# EAGLE design shiftReg (EAGLE 9.6.2)
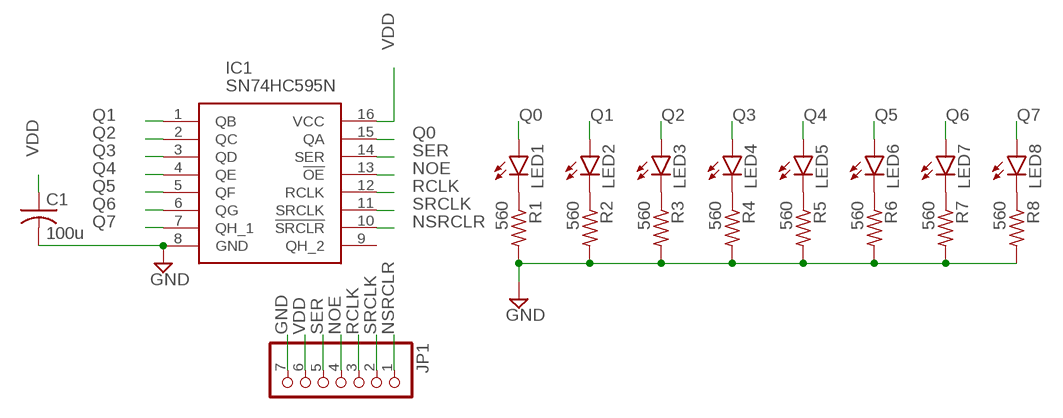
[diagram p0: schematic, sheet 1]

## Parts
C1  100u  C-USC0805  [C0805]
IC1  SN74HC595N  [DIP794W53P254L1930H508Q16N]
JP1  PINHD-1X7  [1X07]
LED1  LEDCHIP-LED0805  [CHIP-LED0805]
LED2  LEDCHIP-LED0805  [CHIP-LED0805]
LED3  LEDCHIP-LED0805  [CHIP-LED0805]
LED4  LEDCHIP-LED0805  [CHIP-LED0805]
LED5  LEDCHIP-LED0805  [CHIP-LED0805]
LED6  LEDCHIP-LED0805  [CHIP-LED0805]
LED7  LEDCHIP-LED0805  [CHIP-LED0805]
LED8  LEDCHIP-LED0805  [CHIP-LED0805]
R1  560  R-US_R0805  [R0805]
R2  560  R-US_R0805  [R0805]
R3  560  R-US_R0805  [R0805]
R4  560  R-US_R0805  [R0805]
R5  560  R-US_R0805  [R0805]
R6  560  R-US_R0805  [R0805]
R7  560  R-US_R0805  [R0805]
R8  560  R-US_R0805  [R0805]

## Nets
GND: C1.2 IC1.8(GND) JP1.7 R1.2 R2.2 R3.2 R4.2 R5.2 R6.2 R7.2 R8.2
N$2: LED1.C R1.1
N$3: LED2.C R2.1
N$4: LED3.C R3.1
N$5: LED4.C R4.1
N$6: LED5.C R5.1
N$7: LED6.C R6.1
N$8: LED7.C R7.1
N$9: LED8.C R8.1
NOE: IC1.13(!OE) JP1.4
NSRCLR: IC1.10(!SRCLR) JP1.1
Q0: IC1.15(QA) LED1.A
Q1: IC1.1(QB) LED2.A
Q2: IC1.2(QC) LED3.A
Q3: IC1.3(QD) LED4.A
Q4: IC1.4(QE) LED5.A
Q5: IC1.5(QF) LED6.A
Q6: IC1.6(QG) LED7.A
Q7: IC1.7(QH_1) LED8.A
RCLK: IC1.12(RCLK) JP1.3
SER: IC1.14(SER) JP1.5
SRCLK: IC1.11(SRCLK) JP1.2
VDD: C1.1 IC1.16(VCC) JP1.6
Unconnected: IC1.9(QH_2)

## Library data of the parts
C1 = rcl:C-US: CAPACITOR, American symbol; SPICEPREFIX: C
IC1 = SamacSys_Parts:SN74HC595N: 8-Bit Shift Registers With 3-State Output Registers Source: Datasheet <http://www.ti.com/lit/ds/symlink/sn74hc595.pdf>; DESCRIPTION: 8-Bit Shift Registers With 3-State Output Registers; HEIGHT: 5.08mm; MANUFACTURER_NAME: Texas Instruments; MANUFACTURER_PART_NUMBER: SN74HC595N; MOUSER_PART_NUMBER: 595-SN74HC595N; MOUSER_PRICE-STOCK: https://www.mouser.co.uk/ProductDetail/Texas-Instruments/SN74HC595N?qs=IEl3ej0IqwBTHkYa8XPoMQ%3D%3D
JP1 = pinhead:PINHD-1X7: PIN HEADER
LED1-LED8 = led:LED: LED OSRAM: - CHIPLED LG R971, LG N971, LY N971, LG Q971, LY Q971, LO R971, LY R971 LH N974, LH R974 LS Q976, LO Q976, LY Q976 LO Q996 - Hyper CHIPLED LW Q18S LB Q993, LB Q99A, LB R99A - SideLED LS A670, LO A670, LY A670, LG A670, LP A670 LB A673, LV A673, LT A673, LW A673 LH A674 LY A675 LS A676, LA A676, LO A676, LY A676, LW A676 LS A679, LY A679, LG A679 - Hyper Micro SIDELED® LS Y876, LA Y876, LO Y876, LY Y876 LT Y87S - SmartLED LW L88C, LW L88S LB L89C, LB L89S, LG L890 LS L89K, LO L89K, LY L89K LS L896, LA L896, LO L896, LY L896 - TOPLED LS T670, LO T670, LY T670, LG T670, LP T670 LSG T670, LSP T670, LSY T670, LOP T670, LYG T670 LG T671, LOG T671, LSG T671 LB T673, LV T673, LT T673, LW T673 LH T674 LS T676, LA T676, LO T676, LY T676, LB T676, LH T676, LSB T676, LW T676 LB T67C, LV T67C, LT T67C, LS T67K, LO T67K, LY T67K, LW E67C LS E67B, LA E67B, LO E67B, LY E67B, LB E67C, LV E67C, LT E67C LW T67C LS T679, LY T679, LG T679 LS T770, LO T770, LY T770, LG T770, LP T770 LB T773, LV T773, LT T773, LW T773 LH T774 LS E675, LA E675, LY E675, LS T675 LS T776, LA T776, LO T776, LY T776, LB T776 LHGB T686 LT T68C, LB T68C - Hyper Mini TOPLED® LB M676 - Mini TOPLED Santana® LG M470 LS M47K, LO M47K, LY M47K Source: http://www.osram.convergy.de LUXEON: - LUMILED® LXK2-PW12-R00, LXK2-PW12-S00, LXK2-PW14-U00, LXK2-PW14-V00 LXK2-PM12-R00, LXK2-PM12-S00, LXK2-PM14-U00 LXK2-PE12-Q00, LXK2-PE12-R00, LXK2-PE12-S00, LXK2-PE14-T00, LXK2-PE14-U00 LXK2-PB12-K00, LXK2-PB12-L00, LXK2-PB12-M00, LXK2-PB14-N00, LXK2-PB14-P00, LXK2-PB14-Q00 LXK2-PR12-L00, LXK2-PR12-M00, LXK2-PR14-Q00, LXK2-PR14-R00 LXK2-PD12-Q00, LXK2-PD12-R00, LXK2-PD12-S00 LXK2-PH12-R00, LXK2-PH12-S00 LXK2-PL12-P00, LXK2-PL12-Q00, LXK2-PL12-R00 Source: www.luxeon.com KINGBRIGHT: KA-3528ASYC Source: www.kingbright.com
R1-R8 = rcl:R-US_: RESISTOR, American symbol; SPICEPREFIX: R

## Board
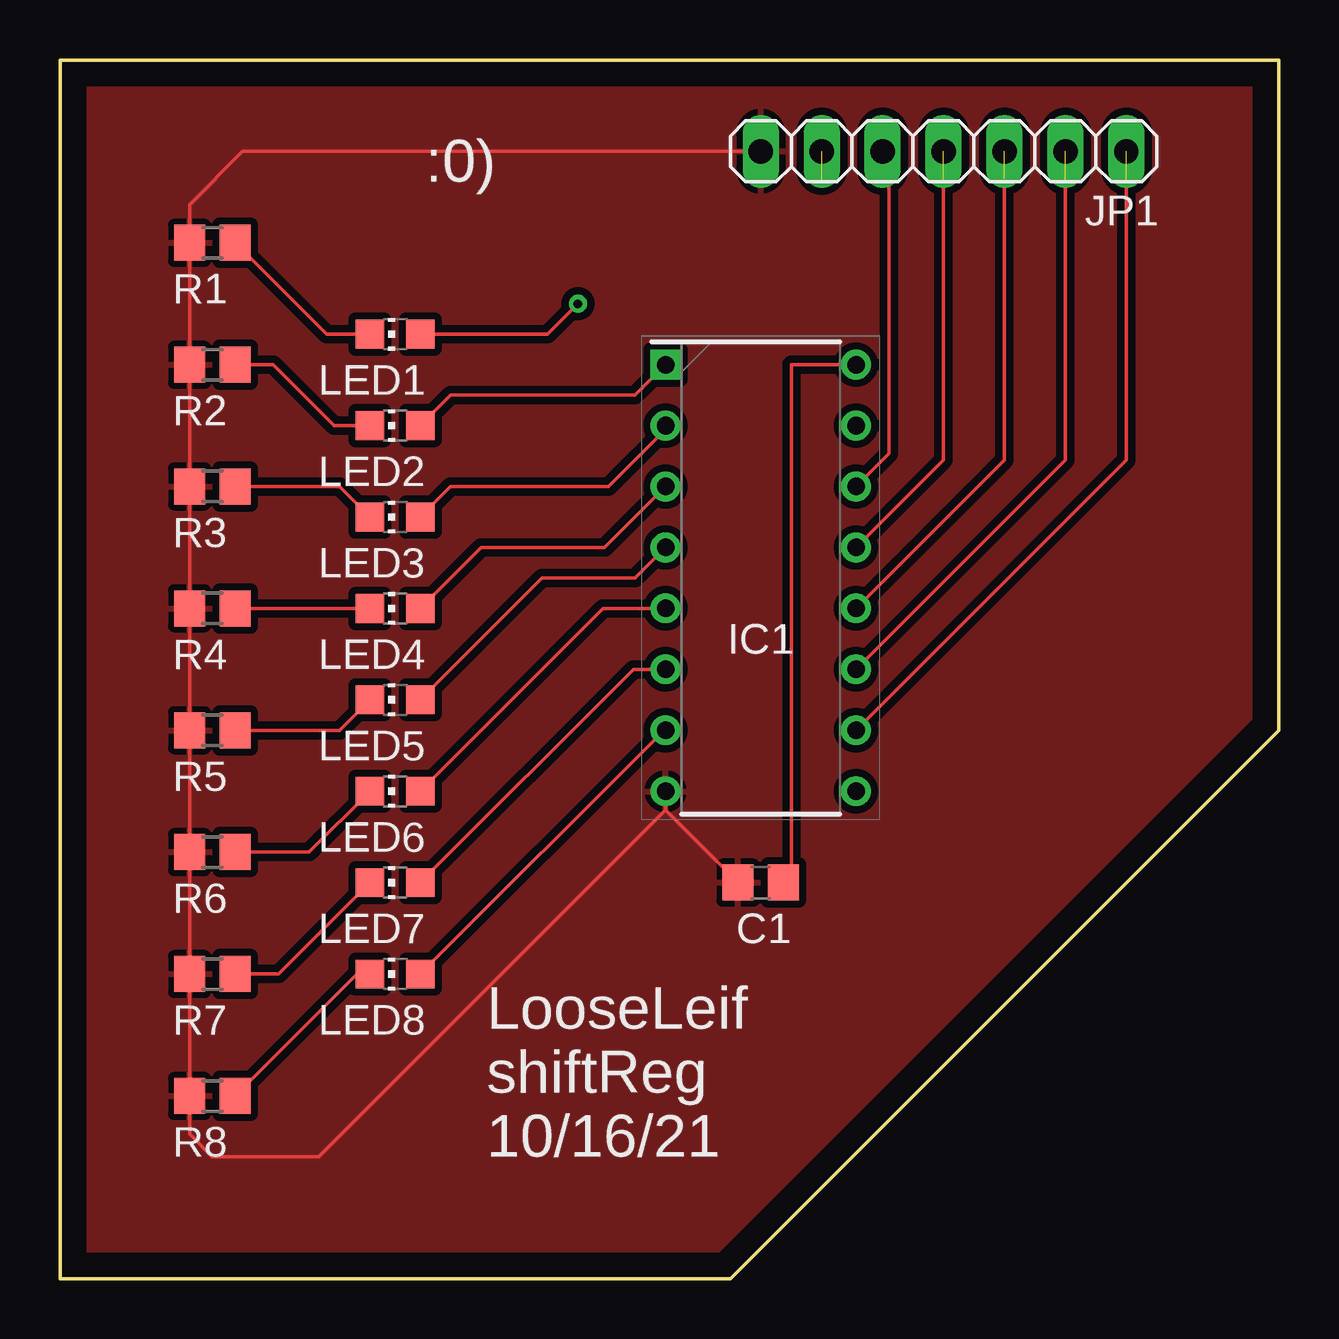
[diagram p1: board, top side]
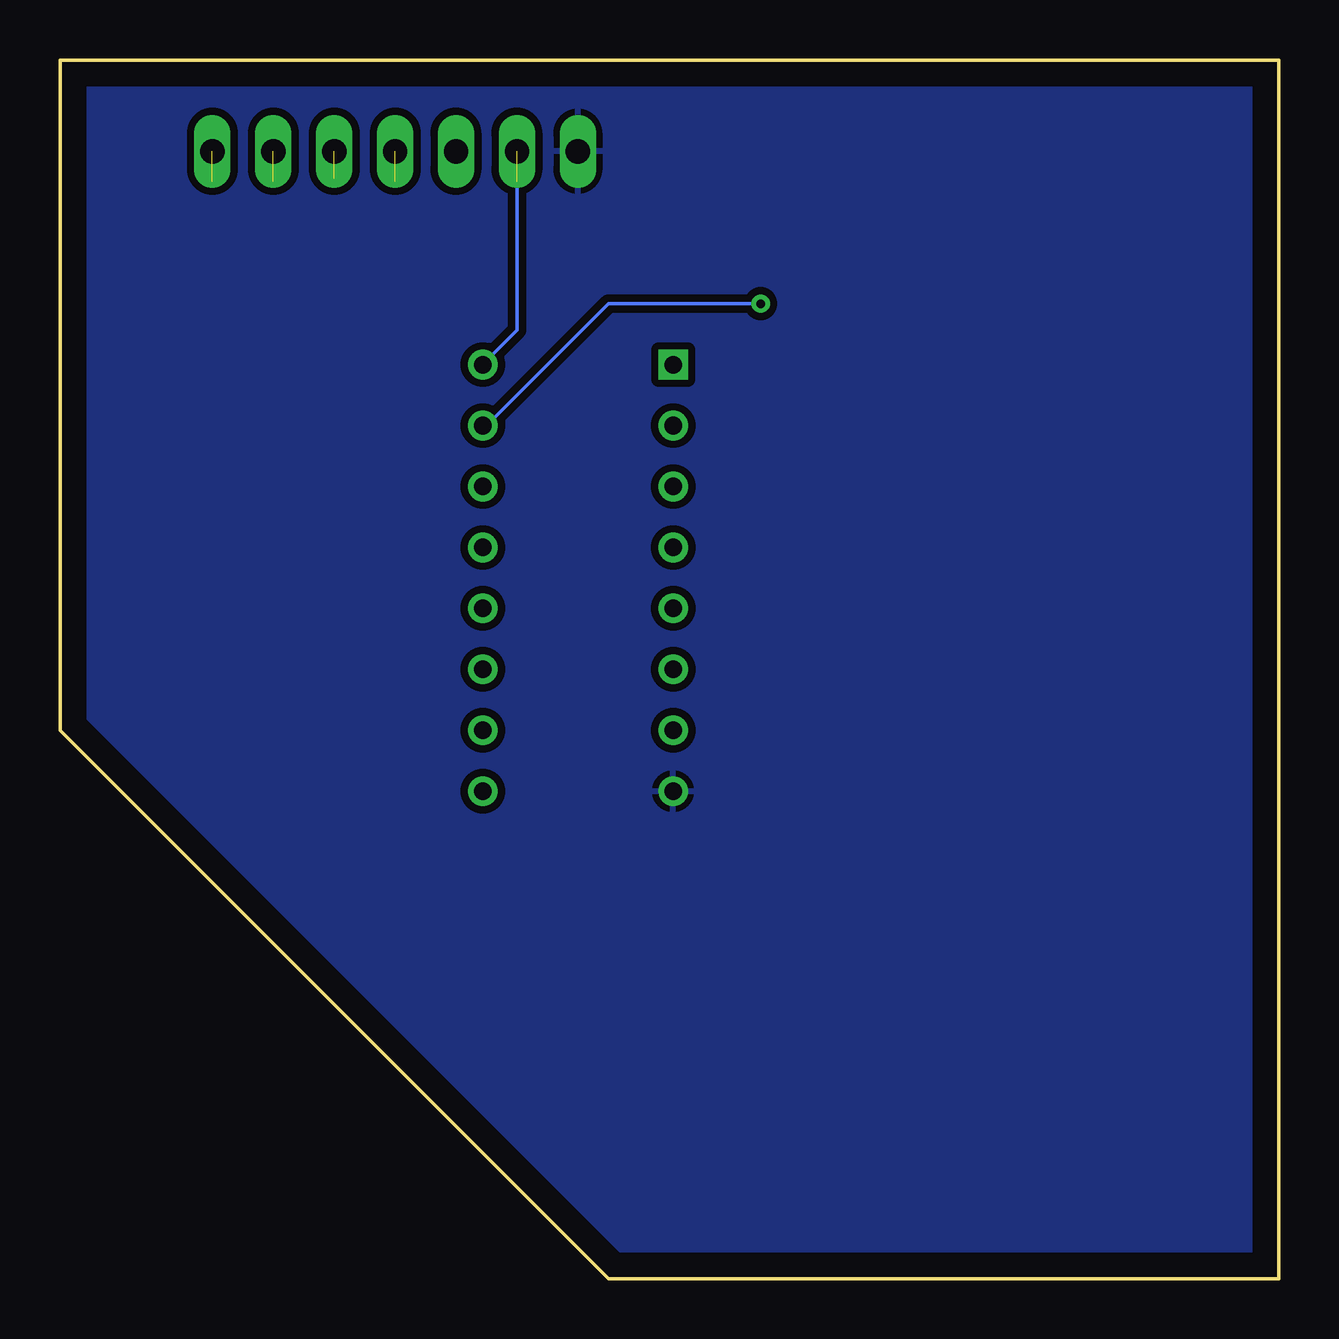
[diagram p2: board, bottom side, seen from below]

Size 50.8 x 50.8 mm. Coordinates in mm from the lower left corner, seen from the top.
Outline: 0,50.8 0,0 27.94,0 50.8,22.86 50.8,50.8 0,50.8
Copper layers (1*16): Top 0.035mm / dielectric 1.5mm / Bottom 0.035mm
Design rules "default": minimum track width 6mil, minimum drill 0.35mm, track to track 6mil, track to pad 6mil, pad to pad 6mil, via to via 6mil, smd to smd 6mil, copper to edge 40mil, drill to drill 6mil, minimum pad ring 10mil, minimum via ring 8mil, stop-mask expansion 4mil, vias tented up to drill 0mil, thermal gap 10mil

### Footprints (pad centres in the part's own frame; a part is rotated, then mirrored left to right if it is on the bottom)
C0805 = smd 1.3 x 1.5: 1 -0.95,0; 2 0.95,0
DIP794W53P254L1930H508Q16N = drill 0.73 pad 1.13 square: 1 -3.97,8.89 | drill 0.73 pad 1.13: 2 -3.97,6.35; 3 -3.97,3.81; 4 -3.97,1.27; 5 -3.97,-1.27; 6 -3.97,-3.81; 7 -3.97,-6.35; 8 -3.97,-8.89; 9 3.97,-8.89; 10 3.97,-6.35; 11 3.97,-3.81; 12 3.97,-1.27; 13 3.97,1.27; 14 3.97,3.81; 15 3.97,6.35; 16 3.97,8.89
1X07 = drill 1.016 long: 1 -7.62,0; 2 -5.08,0; 3 -2.54,0; 4 0,0; 5 2.54,0; 6 5.08,0; 7 7.62,0
CHIP-LED0805 = smd 1.2 x 1.2: A 0,-1.05; C 0,1.05
R0805 = smd 1.3 x 1.5: 1 -0.95,0; 2 0.95,0

### Placement (x,y rotation side)
C1  29.21,16.51 180 top
IC1  29.21,29.21 0 top
JP1  36.83,46.99 180 top
LED1  13.97,39.37 90 top
LED2  13.97,35.56 90 top
LED3  13.97,31.75 90 top
LED4  13.97,27.94 90 top
LED5  13.97,24.13 90 top
LED6  13.97,20.32 90 top
LED7  13.97,16.51 90 top
LED8  13.97,12.7 90 top
R1  6.35,43.18 180 top
R2  6.35,38.1 180 top
R3  6.35,33.02 180 top
R4  6.35,27.94 180 top
R5  6.35,22.86 180 top
R6  6.35,17.78 180 top
R7  6.35,12.7 180 top
R8  6.35,7.62 180 top

### Tracks (layer width: path | path; a pad name or v marks a point on that pad's centre or on a via)
GND
  Top 0.152: JP1.7 7.62,46.99 5.4,44.77 R1.2 R2.2 R3.2 R4.2 R5.2 R6.2 R7.2 R8.2 5.4,6.03 6.35,5.08 10.79,5.08 25.24,19.53 | C1.2 25.24,19.53 | 25.24,19.53 IC1.8
  pour Top (isolate 0.305): 0,50.8 0,0 27.94,0 50.8,22.86 50.8,50.8
  pour Bottom (isolate 0.305): 0,50.8 0,0 27.94,0 50.8,22.86 50.8,50.8
N$2
  Top 0.152: R1.1 11.11,39.37 LED1.C
N$3
  Top 0.152: R2.1 8.89,38.1 11.43,35.56 LED2.C
N$4
  Top 0.152: R3.1 11.65,33.02 LED3.C
N$5
  Top 0.152: R4.1 LED4.C
N$6
  Top 0.152: R5.1 11.65,22.86 LED5.C
N$7
  Top 0.152: R6.1 10.38,17.78 LED6.C
N$8
  Top 0.152: R7.1 9.11,12.7 LED7.C
N$9
  Top 0.152: R8.1 12.38,12.7 LED8.C
NOE  (1 unrouted)
  Top 0.152: IC1.13 36.83,34.13 36.83,45.72
NSRCLR  (1 unrouted)
  Top 0.152: IC1.10 44.45,34.13 44.45,45.72
Q0  (via drill 0.35)
  Top 0.152: v21.59,40.64 20.32,39.37 LED1.A
  Bottom 0.152: IC1.15 33.02,35.56 27.94,40.64 v21.59,40.64
Q1
  Top 0.152: LED2.A 16.29,36.83 23.97,36.83 IC1.1
Q2
  Top 0.152: LED3.A 16.29,33.02 22.86,33.02 25.24,35.4 IC1.2
Q3
  Top 0.152: LED4.A 17.56,30.48 22.7,30.48 IC1.3
Q4
  Top 0.152: LED5.A 20.1,29.21 23.97,29.21 IC1.4
Q5
  Top 0.152: LED6.A 22.64,27.94 IC1.5
Q6
  Top 0.152: LED7.A 23.91,25.4 IC1.6
Q7
  Top 0.152: LED8.A 25.18,22.86 IC1.7
RCLK  (1 unrouted)
  Top 0.152: IC1.12 39.37,34.13 39.37,45.85
SER
  Top 0.152: IC1.14 34.54,34.38 34.54,46.74 JP1.5
SRCLK  (1 unrouted)
  Top 0.152: IC1.11 41.91,34.13 41.91,45.72
VDD  (1 unrouted)
  Top 0.152: C1.1 30.48,16.83 30.48,38.1 IC1.16
  Bottom 0.152: IC1.16 31.75,39.53 31.75,45.72

### Text on the board
tPlace: :0) | LooseLeif / shiftReg / 10/16/21